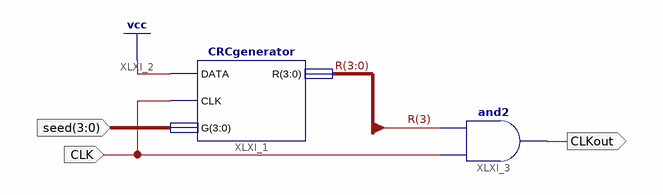
[diagram p0: schematic sheet 1]
// Xilinx ISE schematic RandCLKgen.sch (spartan6) as structural Verilog: 2 symbols, 3 ports
module RandCLKgen (
  input  [3:0] seed,
  input  CLK,
  output CLKout
);

  wire [3:0] R;

  CRCgenerator XLXI_1 (.DATA(1'b1), .CLK(CLK), .G(seed), .R(R));
  and XLXI_3 (CLKout, CLK, R[3]);
endmodule
